# EAGLE design clock (EAGLE 6.4)
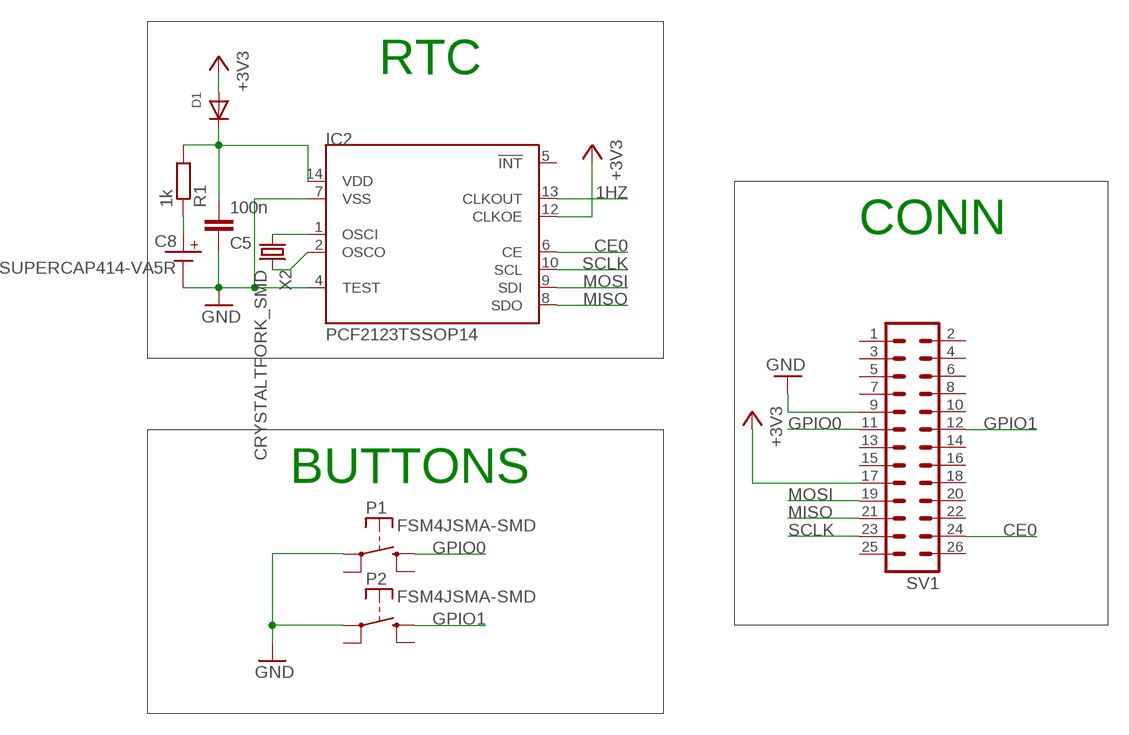
[diagram p0: schematic, sheet 1]

## Parts
C5  100n  C-EUC0603K  [C0603K]
C8  SUPERCAP414-VA5R  [414-VA5R]
D1  DIODESOD-523  [SOD-523]
IC2  PCF2123TSSOP14  [TSSOP14]
P1  FSM4JSMA-SMD  [FSM4JSMA-SMD]
P2  FSM4JSMA-SMD  [FSM4JSMA-SMD]
R1  1k  R-EU_R0603  [R0603]
SV1  MA13-2  [MA13-2]
X2  CRYSTALTFORK_SMD  [TFORK_SMD]

## Nets
1HZ: IC2.13(CLKOUT)
+3V3: D1.A IC2.12(CLKOE) SV1.17
CE0: IC2.6(CE) SV1.24
GND: C5.1 C8.MINUS IC2.4(TEST) IC2.7(VSS) P1.P$1(P) P2.P$1(P) SV1.9
GPIO0: P1.P$3(S) SV1.11
GPIO1: P2.P$3(S) SV1.12
MISO: IC2.8(SDO) SV1.21
MOSI: IC2.9(SDI) SV1.19
N$3: IC2.2(OSCO) X2.3
N$4: IC2.1(OSCI) X2.2
N$9: C8.PLUS R1.1
SCLK: IC2.10(SCL) SV1.23
VRTC: C5.2 D1.K(C) IC2.14(VDD) R1.2
Unconnected: IC2.5(!INT) P1.P$2(P) P1.P$4(S) P2.P$2(P) P2.P$4(S) SV1.1 SV1.2 SV1.3 SV1.4 SV1.5 SV1.6 SV1.7 SV1.8 SV1.10 SV1.13 SV1.14 SV1.15 SV1.16 SV1.18 SV1.20 SV1.22 SV1.25 SV1.26

## Notes on the sheet
- RTC
- CONN
- BUTTONS

## Library data of the parts
C5 = rcl:C-EU: CAPACITOR, European symbol
C8 = jocki:SUPERCAP
D1 = adafruit:DIODE: Diode SMADIODE - SMA Surface Mount Package 20V 1A Schottky Diode Digikey: 641-1014-6-ND DO-1N4148 - Through Hole Small Current Diode SOD-123 20V 1 A (.5mV Vf) Schottky Diode - Digikey: MBRX120TPMSCT-ND SOD-323 10V 570mA (.38mV Vf, 3ns) Schottky Diode - Digikey: ZLLS410CT-ND SOD-523 30V 30mA Schottky Diode (RB751S-40TE61) - Digikey: RB751S-40TE61CT-ND SOT23-R/W - SOT23 Package (R = Solder Paste/Reflow Ovens, W = Hand-Soldering) BAT54Film 40V 300mA - Digikey: 497-7162-1-ND
IC2 = jocki:PCF2123: edit this description Auto generated by make-symbol-device-package-bsdl.ulp Rev. 43 Source:
P1 P2 = switch-misc:FSM4JSMA-SMD: TYCO SWITCH
R1 = rcl:R-EU_: RESISTOR, European symbol
SV1 = con-lstb:MA13-2: PIN HEADER; OC_FARNELL: unknown; OC_NEWARK: unknown
X2 = jocki:CRYSTAL

## Board
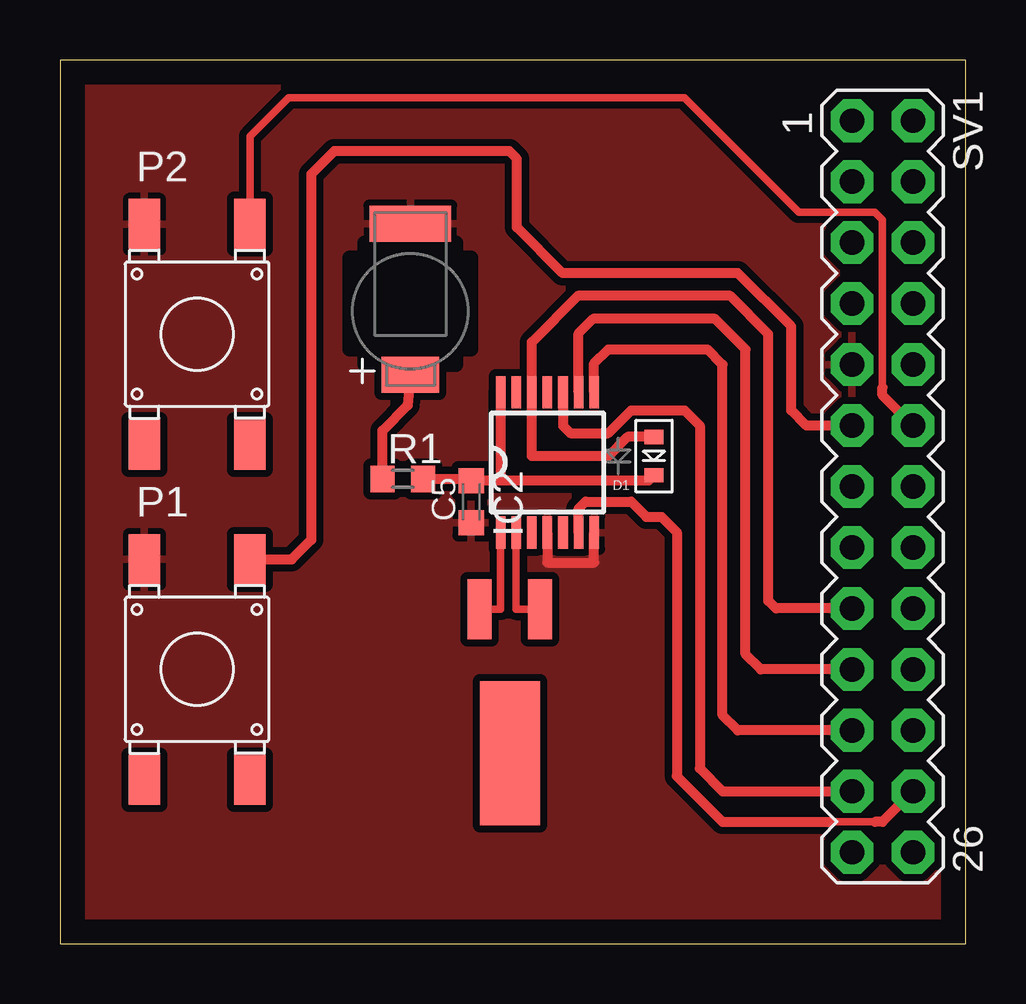
[diagram p1: board, top side]

Size 37.77 x 36.82 mm. Coordinates in mm from the lower left corner, seen from the top.
Outline: 0,0 37.77,0 37.77,36.82 0,36.82 0,0
Copper layers (1*16): Top 0.035mm / dielectric 1.5mm / Bottom 0.035mm
Design rules "default *": minimum track width 10mil, minimum drill 24mil, track to track 8mil, track to pad 8mil, pad to pad 8mil, via to via 8mil, smd to smd 8mil, copper to edge 40mil, drill to drill 8mil, minimum pad ring 15mil, minimum via ring 8mil, stop-mask expansion 4mil, vias tented up to drill 0mil, thermal gap 10mil
tRestrict: area 12.1,24.8 to 17.1,28.6; area 12.7,24.1 to 16.5,29.2

### Footprints (pad centres in the part's own frame; a part is rotated, then mirrored left to right if it is on the bottom)
C0603K = smd 1.05 x 1.08: 1 -0.875,0; 2 0.875,0
414-VA5R = smd 1.5 x 3.4: MINUS 3.65,0 | smd 1.5 x 2.4: PLUS -2.65,0
SOD-523 = smd 0.8 x 0.6: A 0,-0.8; K 0,0.8
TSSOP14 = smd 1.35 x 0.4: 1 -2.925,1.95; 2 -2.925,1.3; 3 -2.925,0.65; 4 -2.925,0; 5 -2.925,-0.65; 6 -2.925,-1.3; 7 -2.925,-1.95; 8 2.925,-1.95; 9 2.925,-1.3; 10 2.925,-0.65; 11 2.925,0; 12 2.925,0.65; 13 2.925,1.3; 14 2.925,1.95
FSM4JSMA-SMD = smd 1.3 x 2.1: P$1 -2.196,4.584; P$2 -2.196,-4.6; P$3 2.204,4.584; P$4 2.204,-4.6
R0603 = smd 1 x 1.1: 1 -0.85,0; 2 0.85,0
MA13-2 = drill 1.016 octagon: 1 -15.24,-1.27; 2 -15.24,1.27; 3 -12.7,-1.27; 4 -12.7,1.27; 5 -10.16,-1.27; 6 -10.16,1.27; 7 -7.62,-1.27; 8 -7.62,1.27; 9 -5.08,-1.27; 10 -5.08,1.27; 11 -2.54,-1.27; 12 -2.54,1.27; 13 0,-1.27; 14 0,1.27; 15 2.54,-1.27; 16 2.54,1.27; 17 5.08,-1.27; 18 5.08,1.27; 19 7.62,-1.27; 20 7.62,1.27; 21 10.16,-1.27; 22 10.16,1.27; 23 12.7,-1.27; 24 12.7,1.27; 25 15.24,-1.27; 26 15.24,1.27
TFORK_SMD = smd 6 x 2.5: 1 -3,0 | smd 2.5 x 1: 2 3,1.252; 3 3,-1.252

### Placement (x,y rotation side)
C5  17.14,18.41 90 top
C8  14.61,26.35 90 top
D1  24.77,20.32 180 top
IC2  20.32,20.05 90 top
P1  5.71,11.43 0 top
P2  5.71,25.4 0 top
R1  14.29,19.37 0 top
SV1  34.29,19.05 270 top
X2  18.75,10.95 90 top

### Tracks (layer width: path | path; a pad name or v marks a point on that pad's centre or on a via)
+3V3
  Top 0.406: D1.A 23.66,21.12 22.86,20.32 19.67,20.32 IC2.12 19.67,25.07 21.59,26.99 27.94,26.99 29.53,25.4 29.53,14.29 29.84,13.97 SV1.17
CE0
  Top 0.305: 32.07,5.08 33.97,5.08
  Top 0.406: IC2.6 21.62,18.13 21.91,18.41 23.81,18.41 24.45,17.78 25.08,17.78 25.72,17.14 25.72,6.99 27.62,5.08 32.07,5.08 | SV1.24 34.29,5.08 33.97,5.08
GND
  Top 0.406: IC2.4 20.32,15.88 22.27,15.88 IC2.7
  pour Top (isolate 0.305): 0,36.83 0,0 38.1,0 38.1,36.83
GPIO0
  Top 0.406: SV1.11 31.11,21.59 30.48,22.23 30.48,25.72 28.26,27.94 20.95,27.94 19.05,29.84 19.05,32.7 18.73,33.02 11.43,33.02 10.48,32.07 10.48,16.83 9.66,16.01 P1.P$3
GPIO1
  Top 0.305: 34.29,23.18 34.29,30.16 33.97,30.48 30.8,30.48 26.04,35.24 9.53,35.24 7.92,33.64 P2.P$3
  Top 0.406: SV1.12 34.29,22.86 34.29,23.18
MISO
  Top 0.406: SV1.21 28.26,8.89 27.62,9.53 27.62,24.13 26.99,24.77 22.86,24.77 22.27,24.18 IC2.8
MOSI
  Top 0.406: SV1.19 29.21,11.43 28.57,12.06 28.57,24.77 27.3,26.04 22.23,26.04 21.62,25.43 IC2.9
N$3
  Top 0.305: IC2.2 19.02,13.95 X2.3
N$4
  Top 0.305: IC2.1 18.37,13.95 X2.2
N$9
  Top 0.406: C8.PLUS 14.49,22.43 13.44,21.38 R1.1
SCLK
  Top 0.406: IC2.10 20.97,21.57 21.27,21.27 22.86,21.27 23.81,22.23 26.04,22.23 26.67,21.59 26.67,7.3 27.62,6.35 SV1.23
VRTC
  Top 0.406: 18.37,19.29 24.54,19.29 D1.K | 18.37,19.29 C5.2 17.07,19.37 R1.2 | IC2.14 18.37,19.29